# Altium schematic sheet 1XGSH00_EEPROM.SchDoc
size A4
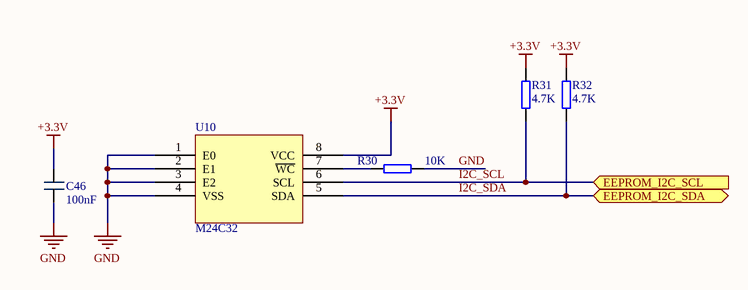
[diagram p0: 1XGSH00_EEPROM.SchDoc]

## Parts
C46  100nF  [0402_C]
R30  10K  [0402_R]
R31  4.7K  [0402_R]
R32  4.7K  [0402_R]
U10  M24C32  [UDFN-8L]

## Ports
EEPROM_I2C_SCL (in), EEPROM_I2C_SDA (bidir)

## Nets
+3.3V: C46.2(-) R31.1 R32.1 U10.8(VCC)
GND: C46.1(-) R30.2 U10.1(E0) U10.2(E1) U10.3(E2) U10.4(VSS)
I2C_SCL: R31.2 U10.6(SCL) ; port EEPROM_I2C_SCL
I2C_SDA: R32.2 U10.5(SDA) ; port EEPROM_I2C_SDA
NetR30_1: R30.1 U10.7(~{WC})

## Library data of the parts
C46 = Capacitor
R30-R32 = Resistor: Value: 1K
U10 = M24C32: EEPROM